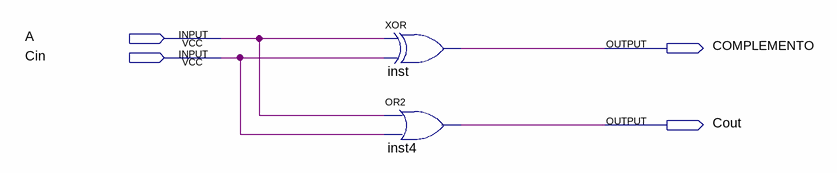
[diagram p0: schematic sheet]
// Quartus schematic COMPLEMENTO1-DIAGRAMA.bdf as structural Verilog: 2 symbols, 4 pins
module \COMPLEMENTO1-DIAGRAMA  (
  input  A,
  input  Cin,
  output COMPLEMENTO,
  output Cout
);

  xor inst (COMPLEMENTO, A, Cin);
  or inst4 (Cout, A, Cin);
endmodule
